# Altium schematic sheet Sheet2.SchDoc
size 420 x 297 mm; SheetNumber: 2; PageSetup: Record=PageOptions|CenterHorizontal=True|CenterVertical=True|PrintScale=0.49|XCorrection=1.00|YCorrection=1.00|PrintKind=1|BorderSize=5000000|LeftOffset=0|BottomOffset=0|Orientation=2|PaperLength=1000|PaperWidth=1000|Scale=100|PaperSource=7|PrintQuality=-4|MediaType=1|DitherType=10|PrintScaleMode=1|PaperKind=A4; DecimalNumber: АЧАД.468224.ххх Э3; HeadOfSector: Нач. сектора; MainDevice: Перв.примен.; Name: Наименование; DecimalNumber_MIRROR: Э3 ххх.422.864.ДАЧА
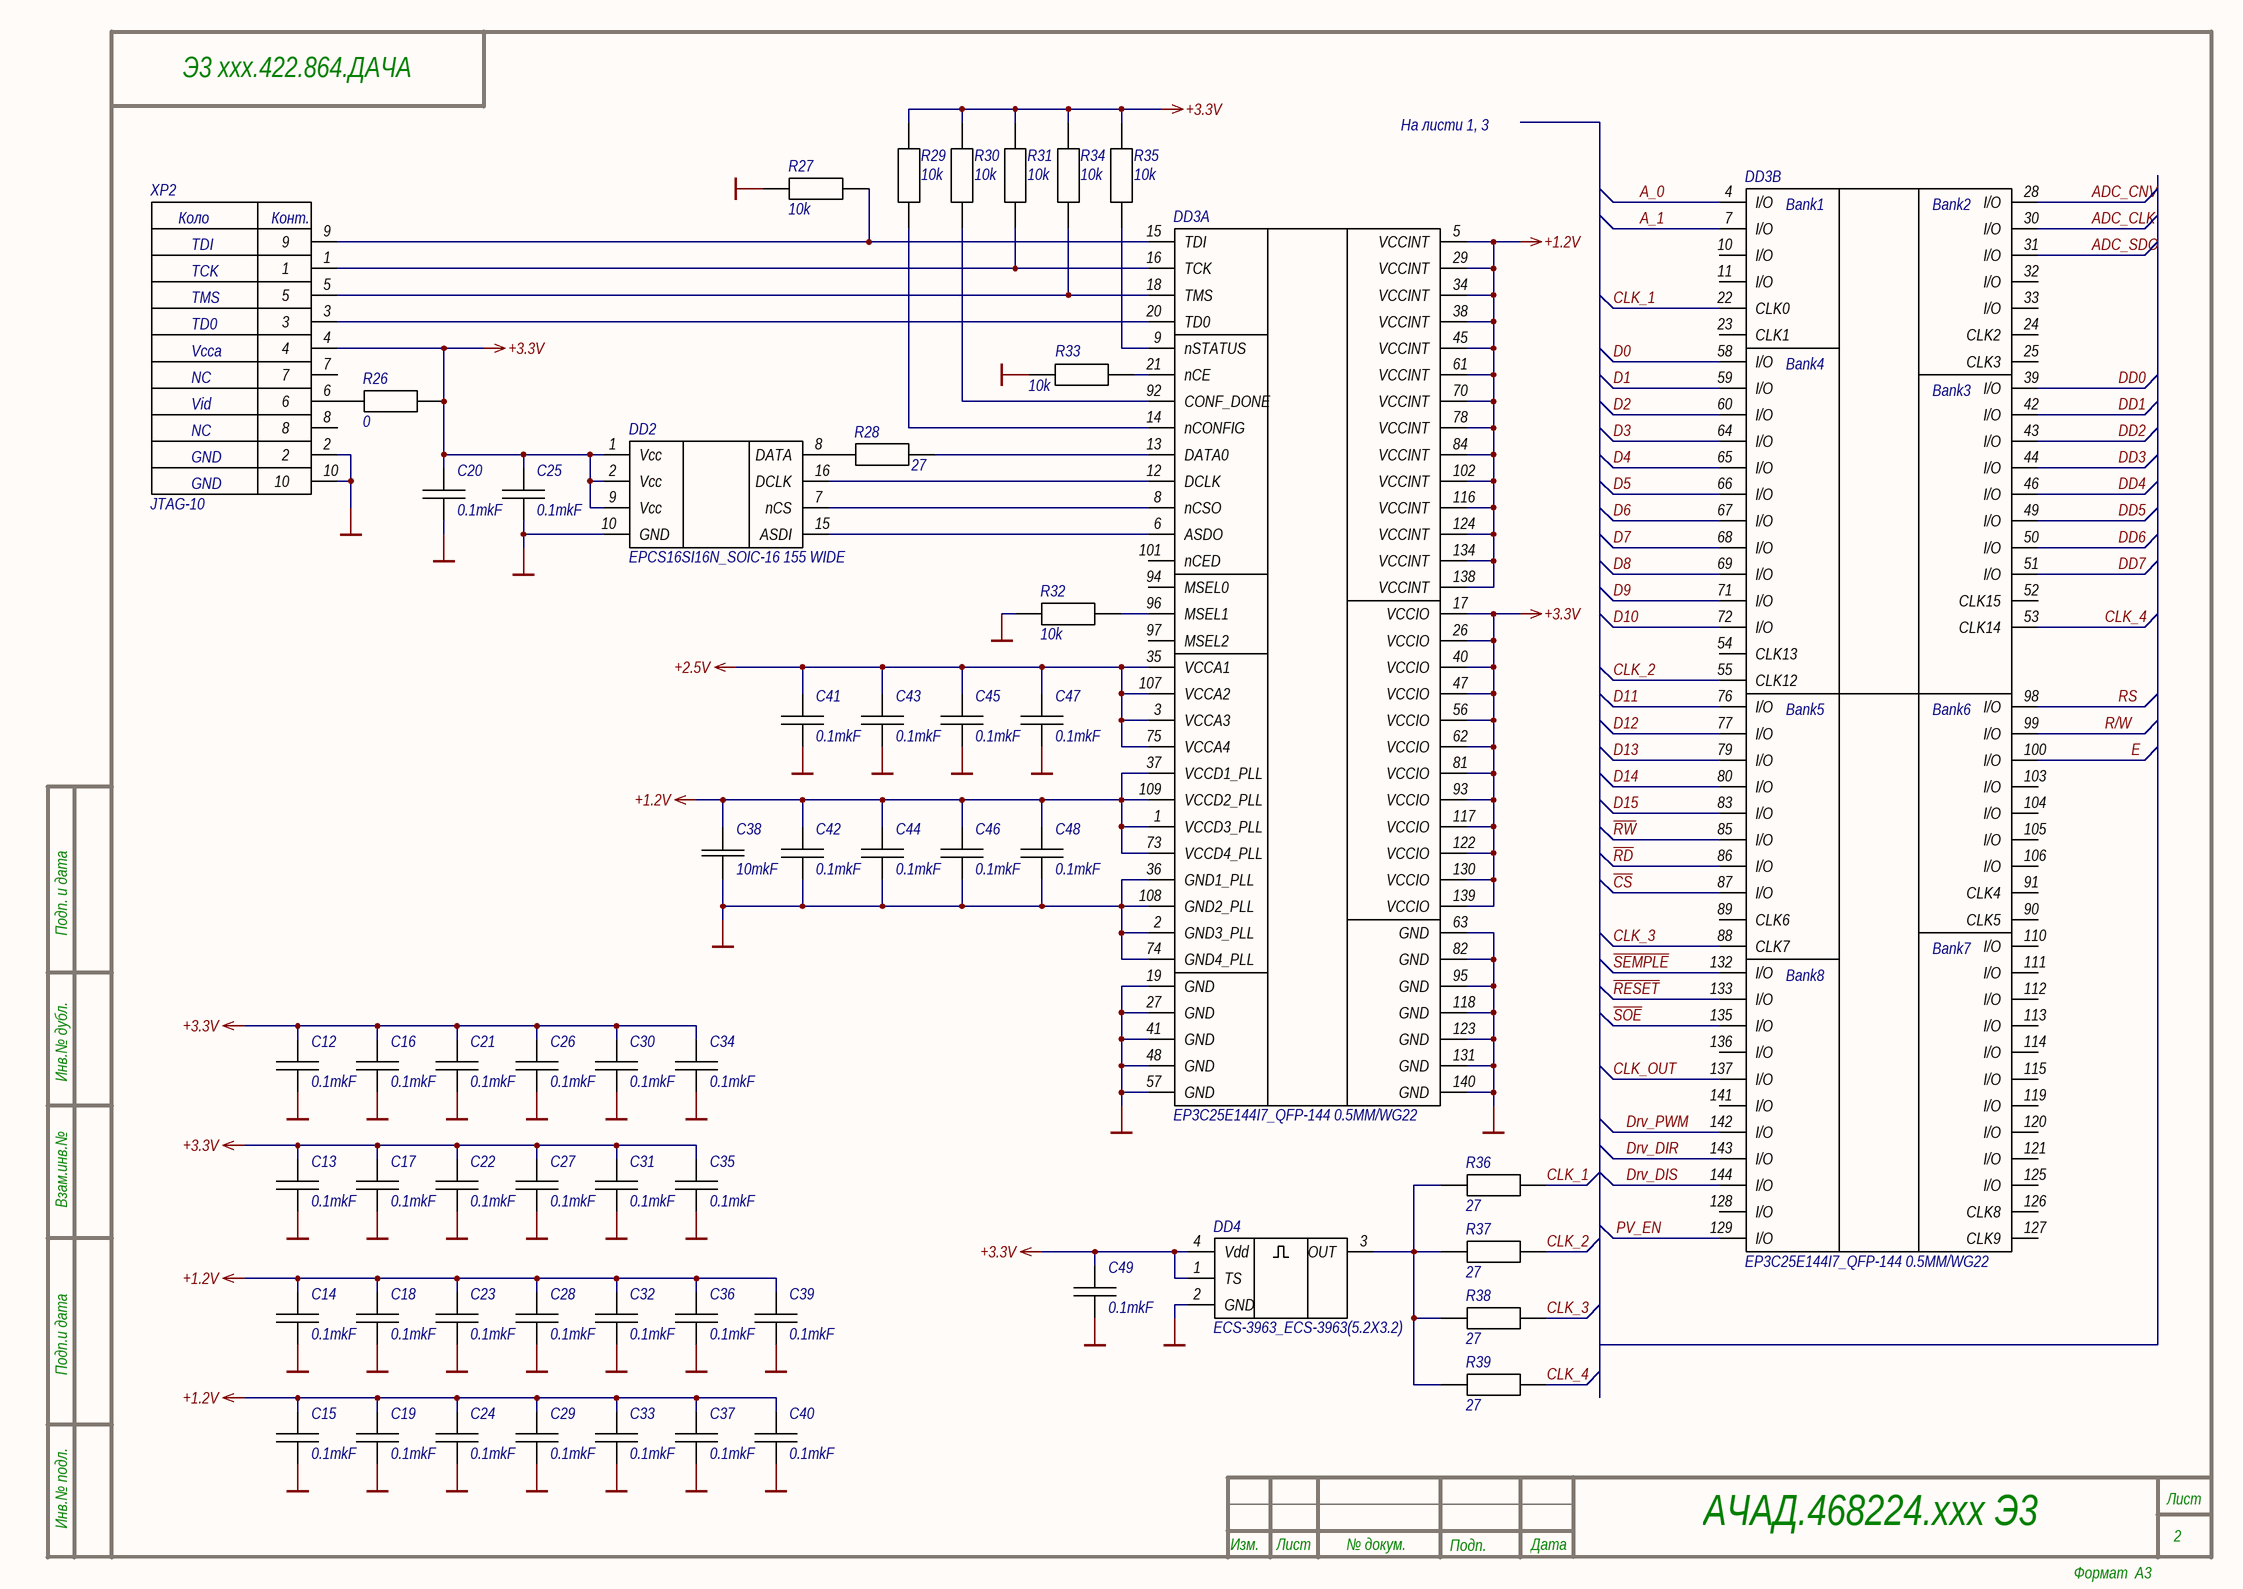
[diagram p0: Sheet2.SchDoc]

## Parts
C12  0.1mkF  [C_0603]
C13  0.1mkF  [C_0603]
C14  0.1mkF  [C_0603]
C15  0.1mkF  [C_0603]
C16  0.1mkF  [C_0603]
C17  0.1mkF  [C_0603]
C18  0.1mkF  [C_0603]
C19  0.1mkF  [C_0603]
C20  0.1mkF  [C_0603]
C21  0.1mkF  [C_0603]
C22  0.1mkF  [C_0603]
C23  0.1mkF  [C_0603]
C24  0.1mkF  [C_0603]
C25  0.1mkF  [C_0603]
C26  0.1mkF  [C_0603]
C27  0.1mkF  [C_0603]
C28  0.1mkF  [C_0603]
C29  0.1mkF  [C_0603]
C30  0.1mkF  [C_0603]
C31  0.1mkF  [C_0603]
C32  0.1mkF  [C_0603]
C33  0.1mkF  [C_0603]
C34  0.1mkF  [C_0603]
C35  0.1mkF  [C_0603]
C36  0.1mkF  [C_0603]
C37  0.1mkF  [C_0603]
C38  10mkF  [C_1206]
C39  0.1mkF  [C_0603]
C40  0.1mkF  [C_0603]
C41  0.1mkF  [C_0603]
C42  0.1mkF  [C_0603]
C43  0.1mkF  [C_0603]
C44  0.1mkF  [C_0603]
C45  0.1mkF  [C_0603]
C46  0.1mkF  [C_0603]
C47  0.1mkF  [C_0603]
C48  0.1mkF  [C_0603]
C49  0.1mkF  [C_0603]
DD2  EPCS16SI16N_SOIC-16 155 WIDE  [SOIC127P600X175-16N]
DD3  EP3C25E144I7_QFP-144 0.5MM/WG22  [QFP65P3122X3122X395-144N]  (parts A,B of 2)
DD4  ECS-3963_ECS-3963(5.2X3.2)  [ECS-3961]
R26  0  [R_1206]
R27  10k  [R_0603]
R28  27  [R_1206]
R29  10k  [R_0603]
R30  10k  [R_0603]
R31  10k  [R_0603]
R32  10k  [R_0603]
R33  10k  [R_0603]
R34  10k  [R_0603]
R35  10k  [R_0603]
R36  27  [R_0603]
R37  27  [R_0603]
R38  27  [R_0603]
R39  27  [R_0603]
XP2  JTAG-10

## Nets
+1.2V: C14.2 C15.2 C18.2 C19.2 C23.2 C24.2 C28.2 C29.2 C32.2 C33.2 C36.2 C37.2 C38.2 C39.2 C40.2 C42.2 C44.2 C46.2 C48.2 DD3.1(VCCD3_PLL) DD3.5(VCCINT) DD3.29(VCCINT) DD3.34(VCCINT) DD3.37(VCCD1_PLL) DD3.38(VCCINT) DD3.45(VCCINT) DD3.61(VCCINT) DD3.70(VCCINT) DD3.73(VCCD4_PLL) DD3.78(VCCINT) DD3.84(VCCINT) DD3.102(VCCINT) DD3.109(VCCD2_PLL) DD3.116(VCCINT) DD3.124(VCCINT) DD3.134(VCCINT) DD3.138(VCCINT)
+2.5V: C41.2 C43.2 C45.2 C47.2 DD3.3(VCCA3) DD3.35(VCCA1) DD3.75(VCCA4) DD3.107(VCCA2)
+3.3V: C12.2 C13.2 C16.2 C17.2 C20.2 C21.2 C22.2 C25.2 C26.2 C27.2 C30.2 C31.2 C34.2 C35.2 C49.2 DD2.1(Vcc) DD2.2(Vcc) DD2.9(Vcc) DD3.17(VCCIO) DD3.26(VCCIO) DD3.40(VCCIO) DD3.47(VCCIO) DD3.56(VCCIO) DD3.62(VCCIO) DD3.81(VCCIO) DD3.93(VCCIO) DD3.117(VCCIO) DD3.122(VCCIO) DD3.130(VCCIO) DD3.139(VCCIO) DD4.1(TS) DD4.4(Vdd) R26.1 R29.2 R30.2 R31.2 R34.2 R35.2 XP2.4
GND: C12.1 C13.1 C14.1 C15.1 C16.1 C17.1 C18.1 C19.1 C20.1 C21.1 C22.1 C23.1 C24.1 C25.1 C26.1 C27.1 C28.1 C29.1 C30.1 C31.1 C32.1 C33.1 C34.1 C35.1 C36.1 C37.1 C38.1 C39.1 C40.1 C41.1 C42.1 C43.1 C44.1 C45.1 C46.1 C47.1 C48.1 C49.1 DD2.10(GND) DD3.2(GND3_PLL) DD3.19(GND) DD3.27(GND) DD3.36(GND1_PLL) DD3.41(GND) DD3.48(GND) DD3.57(GND) DD3.63(GND) DD3.74(GND4_PLL) DD3.82(GND) DD3.95(GND) DD3.108(GND2_PLL) DD3.118(GND) DD3.123(GND) DD3.131(GND) DD3.140(GND) DD4.2(GND) R27.1 R32.1 R33.1 XP2.2 XP2.10
A_0: DD3.4(I/O)
A_1: DD3.7(I/O)
ADC_CLK: DD3.30(I/O)
ADC_CNV: DD3.28(I/O)
ADC_SDO: DD3.31(I/O)
~{CS}: DD3.87(I/O)
CLK_1: DD3.22(CLK0) R36.2
CLK_2: DD3.55(CLK12) R37.2
CLK_3: DD3.88(CLK7) R38.2
CLK_4: DD3.53(CLK14) R39.2
CLK_OUT: DD3.137(I/O)
D0: DD3.58(I/O)
D1: DD3.59(I/O)
D2: DD3.60(I/O)
D3: DD3.64(I/O)
D4: DD3.65(I/O)
D5: DD3.66(I/O)
D6: DD3.67(I/O)
D7: DD3.68(I/O)
D8: DD3.69(I/O)
D9: DD3.71(I/O)
D10: DD3.72(I/O)
D11: DD3.76(I/O)
D12: DD3.77(I/O)
D13: DD3.79(I/O)
D14: DD3.80(I/O)
D15: DD3.83(I/O)
DD0: DD3.39(I/O)
DD1: DD3.42(I/O)
DD2: DD3.43(I/O)
DD3: DD3.44(I/O)
DD4: DD3.46(I/O)
DD5: DD3.49(I/O)
DD6: DD3.50(I/O)
DD7: DD3.51(I/O)
Drv_DIR: DD3.143(I/O)
Drv_DIS: DD3.144(I/O)
Drv_PWM: DD3.142(I/O)
E: DD3.100(I/O)
PV_EN: DD3.129(I/O)
R/W: DD3.99(I/O)
~{RD}: DD3.86(I/O)
~{RESET}: DD3.133(I/O)
~{RW}: DD3.85(I/O)
RS: DD3.98(I/O)
~{SEMPLE}: DD3.132(I/O)
~{SOE}: DD3.135(I/O)
NetDD2_7: DD2.7(nCS) DD3.8(nCSO)
NetDD2_8: DD2.8(DATA) R28.1
NetDD2_15: DD2.15(ASDI) DD3.6(ASDO)
NetDD2_16: DD2.16(DCLK) DD3.12(DCLK)
NetDD3_9: DD3.9(nSTATUS) R35.1
NetDD3_13: DD3.13(DATA0) R28.2
NetDD3_14: DD3.14(nCONFIG) R29.1
NetDD3_15: DD3.15(TDI) R27.2 XP2.9
NetDD3_16: DD3.16(TCK) R31.1 XP2.1
NetDD3_18: DD3.18(TMS) R34.1 XP2.5
NetDD3_20: DD3.20(TD0) XP2.3
NetDD3_21: DD3.21(nCE) R33.2
NetDD3_92: DD3.92(CONF_DONE) R30.1
NetDD3_96: DD3.96(MSEL1) R32.2
NetDD4_3: DD4.3(OUT) R36.1 R37.1 R38.1 R39.1
NetR26_2: R26.2 XP2.6

Not connected (* = marked no-connect by the designer): DD3 10(I/O) 11(I/O) 23(CLK1) 24(CLK2) 25(CLK3) 32(I/O) 33(I/O) 52(CLK15) 54(CLK13) 89(CLK6) 90(CLK5) 91(CLK4) 94(MSEL0) 97(MSEL2) 101(nCED) 103(I/O) 104(I/O) 105(I/O) 106(I/O) 110(I/O) 111(I/O) 112(I/O) 113(I/O) 114(I/O) 115(I/O) 119(I/O) 120(I/O) 121(I/O) 125(I/O) 126(CLK8) 127(CLK9) 128(I/O) 136(I/O) 141(I/O); XP2 7 8

## Notes on the sheet
- На листи 1, 3
- Подп. и дата
- Инв.№ дубл.
- Взам.инв.№
- Подп.и дата
- Инв.№ подл.
- Изм.
- Лист
- № докум.
- Подп.
- Дата
- Формат  A3
- (in symbol EP3C25E144I7_QFP-144 0.5MM/WG22, part B) Bank1; Bank2; Bank4; Bank3; Bank5; Bank6; Bank7; Bank8
- (in symbol JTAG-10) Коло; Конт.; TDI; TCK; TMS; TD0; Vcca; NC; Vid; GND

## Library data of the parts
C12-C37 C39-C49 = C_0.1mkF_0603: Value: 0.1mkF
C38 = C_10mkF_1206: Value: 10mkF
R26 R28 = R_10_1206
  R26: Value: 0
  R28: Value: 27
R27 R29-R39 = R_10k_0603
  R27 R29-R35: Value: 10k
  R36-R39: Value: 27